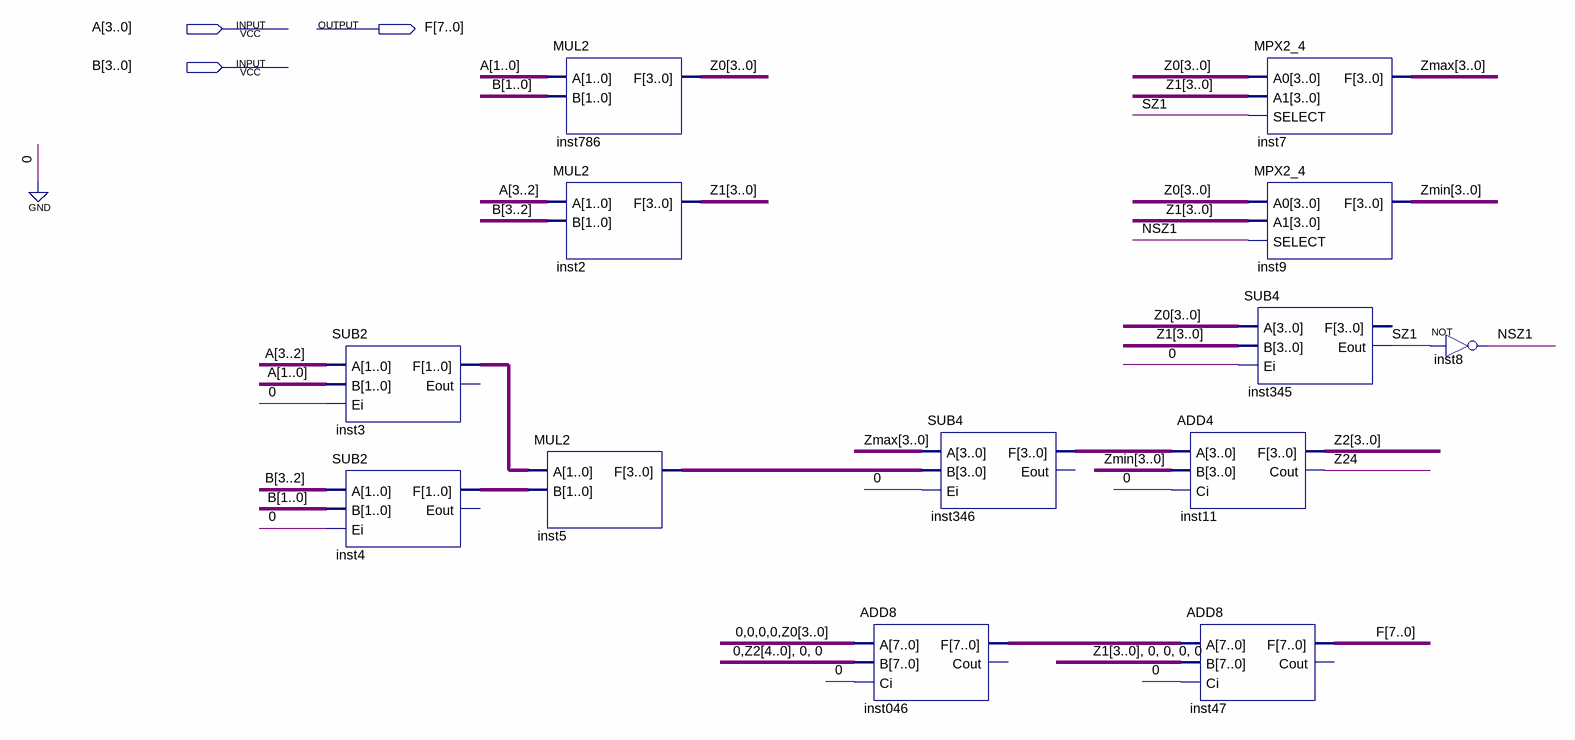
[diagram p0: schematic sheet]
// Quartus schematic MUL4.bdf as structural Verilog: 13 symbols, 3 pins
module MUL4 (
  input  [3:0] A,
  input  [3:0] B,
  output [7:0] F
);

  wire NSZ1, SZ1;
  wire [1:0] inst3_f, inst4_f;
  wire [3:0] inst5_f, inst346_f, Z0, Z1, Zmax, Zmin;
  wire [4:0] Z2;
  wire [7:0] inst046_f;

  SUB2 inst3 (.A(A[3:2]), .B(A[1:0]), .Ei(1'b0), .F(inst3_f));  // open: Eout
  SUB2 inst4 (.A(B[3:2]), .B(B[1:0]), .Ei(1'b0), .F(inst4_f));  // open: Eout
  MUL2 inst786 (.A(A[1:0]), .B(B[1:0]), .F(Z0));
  MUL2 inst2 (.A(A[3:2]), .B(B[3:2]), .F(Z1));
  MUL2 inst5 (.A(inst3_f), .B(inst4_f), .F(inst5_f));
  ADD8 inst046 (.A({4'b0000, Z0}), .B({1'b0, Z2, 2'b00}), .Ci(1'b0), .F(inst046_f));  // open: Cout
  SUB4 inst346 (.A(Zmax), .B(inst5_f), .Ei(1'b0), .F(inst346_f));  // open: Eout
  SUB4 inst345 (.A(Z0), .B(Z1), .Ei(1'b0), .Eout(SZ1));  // open: F
  ADD4 inst11 (.A(inst346_f), .B(Zmin), .Ci(1'b0), .F(Z2[3:0]), .Cout(Z2[4]));
  ADD8 inst47 (.A(inst046_f), .B({Z1, 4'b0000}), .Ci(1'b0), .F(F));  // open: Cout
  MPX2_4 inst7 (.A0(Z0), .A1(Z1), .SELECT(SZ1), .F(Zmax));
  MPX2_4 inst9 (.A0(Z0), .A1(Z1), .SELECT(NSZ1), .F(Zmin));
  not inst8 (NSZ1, SZ1);
endmodule
